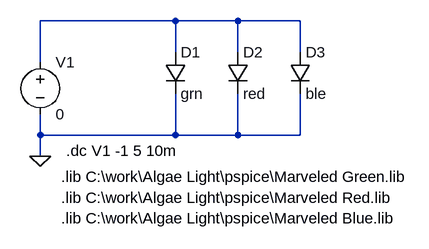
[diagram p0: schematic avago-asmbt.asc]
avago-asmbt.asc, the LTspice schematic file:
Version 4
SHEET 1 960 680
WIRE 304 64 96 64
WIRE 400 64 304 64
WIRE 496 64 400 64
WIRE 304 112 304 64
WIRE 400 112 400 64
WIRE 496 112 496 64
WIRE 96 128 96 64
WIRE 96 240 96 208
WIRE 304 240 304 176
WIRE 304 240 96 240
WIRE 400 240 400 176
WIRE 400 240 304 240
WIRE 496 240 496 176
WIRE 496 240 400 240
WIRE 96 272 96 240
FLAG 96 272 0
SYMBOL voltage 96 112 R0
WINDOW 123 0 0 Left 2
WINDOW 39 0 0 Left 2
SYMATTR InstName V1
SYMATTR Value 0
SYMBOL diode 288 112 R0
SYMATTR InstName D1
SYMATTR Value grn
SYMBOL diode 384 112 R0
SYMATTR InstName D2
SYMATTR Value red
SYMBOL diode 480 112 R0
SYMATTR InstName D3
SYMATTR Value ble
TEXT 136 264 Left 2 !.dc V1 -1 5 10m
TEXT 128 304 Left 2 !.lib C:\\work\\Algae Light\\pspice\\Marveled Green.lib
TEXT 128 336 Left 2 !.lib C:\\work\\Algae Light\\pspice\\Marveled Red.lib
TEXT 128 368 Left 2 !.lib C:\\work\\Algae Light\\pspice\\Marveled Blue.lib

The netlist it stands for:
* avago-asmbt.asc
V1 N001 0 0
D1 N001 0 grn
D2 N001 0 red
D3 N001 0 ble
.model D D
.lib standard.dio
.dc V1 -1 5 10m
.lib C:\work\Algae Light\pspice\Marveled Green.lib
.lib C:\work\Algae Light\pspice\Marveled Red.lib
.lib C:\work\Algae Light\pspice\Marveled Blue.lib
.backanno
.end